# Altium schematic sheet Project_traffic.SchDoc
size A
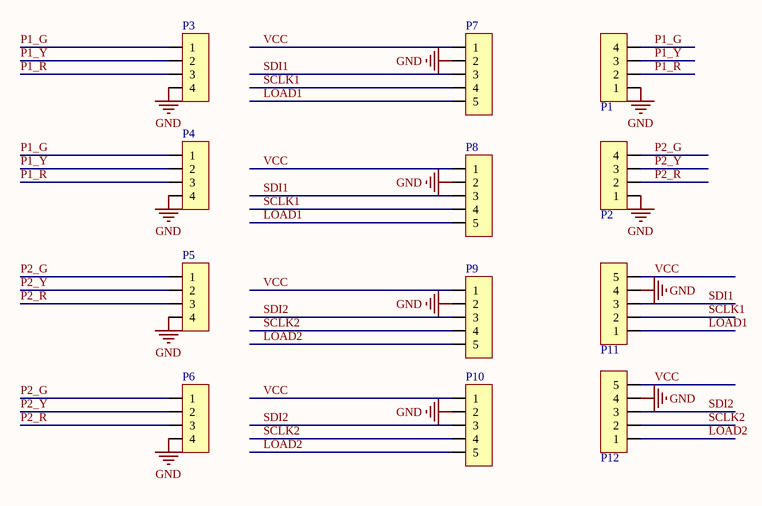
[diagram p0: Project_traffic.SchDoc]

## Parts
P1  Header 4  [Header 4]  (value not drawn)
P2  Header 4  [Header 4]  (value not drawn)
P3  Header 4  [Header 4]  (value not drawn)
P4  Header 4  [Header 4]  (value not drawn)
P5  Header 4  [Header 4]  (value not drawn)
P6  Header 4  [Header 4]  (value not drawn)
P7  Header 5  [Header 5]  (value not drawn)
P8  Header 5  [Header 5]  (value not drawn)
P9  Header 5  [Header 5]  (value not drawn)
P10  Header 5  [Header 5]  (value not drawn)
P11  Header 5  [Header 5]  (value not drawn)
P12  Header 5  [Header 5]  (value not drawn)

## Nets
GND: P1.1 P2.1 P3.4 P4.4 P5.4 P6.4 P7.2 P8.2 P9.2 P10.2 P11.4 P12.4
LOAD1: P7.5 P8.5 P11.1
LOAD2: P9.5 P10.5 P12.1
P1_G: P1.4 P3.1 P4.1
P1_R: P1.2 P3.3 P4.3
P1_Y: P1.3 P3.2 P4.2
P2_G: P2.4 P5.1 P6.1
P2_R: P2.2 P5.3 P6.3
P2_Y: P2.3 P5.2 P6.2
SCLK1: P7.4 P8.4 P11.2
SCLK2: P9.4 P10.4 P12.2
SDI1: P7.3 P8.3 P11.3
SDI2: P9.3 P10.3 P12.3
VCC: P7.1 P8.1 P9.1 P10.1 P11.5 P12.5

## Library data of the parts
P1-P6 = Header 4: Header, 4-Pin
P7-P12 = Header 5: Header, 5-Pin; LatestRevisionDate: 17-Jul-2002; LatestRevisionNote: Re-released for DXP Platform.; Publisher: Altium Limited